# Altium schematic sheet Motor Control - Phase A.SchDoc: [9] Motor Control - Phase A
size A4; ApprovedBy: Nagy Richard; CheckedBy: Nagy Richard; Author: Nagy Richard; CompanyName: EmbedCore; DrawnBy: Nagy Richard; Engineer: Nagy Richard; Organization: EmbedCore; Revision: 1.0; SheetNumber: 9; SheetTotal: 25
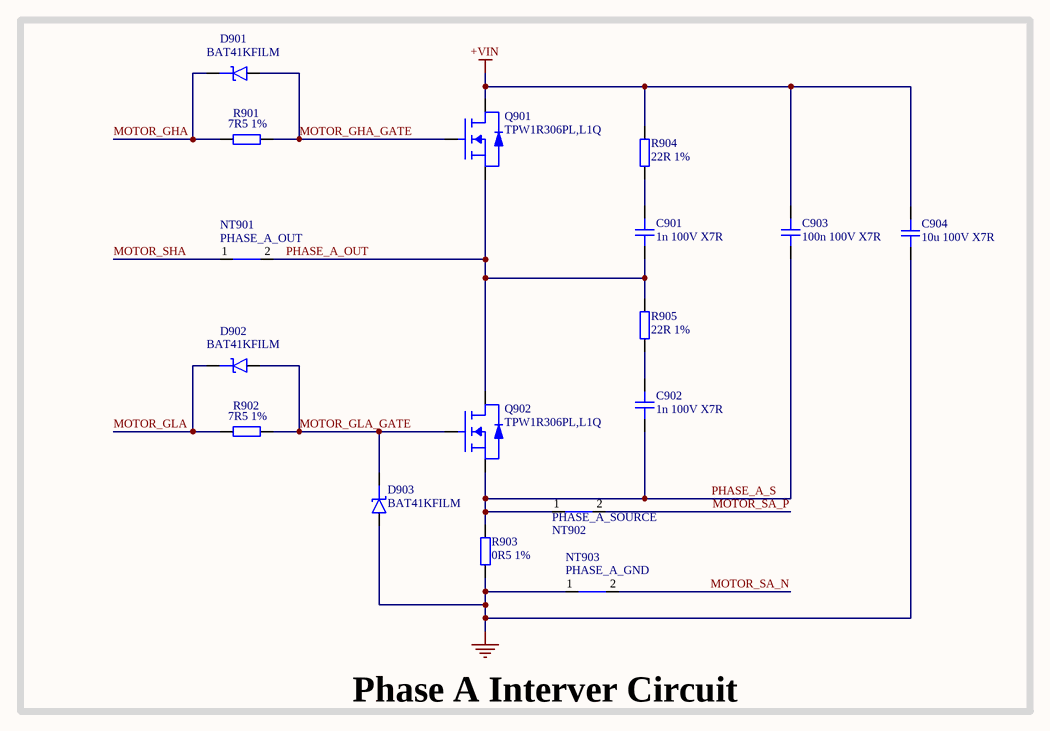
[diagram p0: Motor Control - Phase A.SchDoc]

## Parts
C901  1n 100V X7R  [CAP_0805]
C902  1n 100V X7R  [CAP_0805]
C903  100n 100V X7R  [CAP_1206]
C904  10u 100V X7R  [CAP_1210]
D901  BAT41KFILM  [SOD-523]
D902  BAT41KFILM  [SOD-523]
D903  BAT41KFILM  [SOD-523]
NT901  PHASE_A_OUT  [NETTIE_SMD]  (net tie, no BOM)
NT902  PHASE_A_SOURCE  [NETTIE_SMD]  (net tie, no BOM)
NT903  PHASE_A_GND  [NETTIE_SMD]  (net tie, no BOM)
Q901  TPW1R306PL,L1Q  [PowerPAK-SO-8]
Q902  TPW1R306PL,L1Q  [PowerPAK-SO-8]
R901  7R5 1%  [RES_0603]
R902  7R5 1%  [RES_0603]
R903  0R5 1%  [RES_1206]
R904  22R 1%  [RES_0805]
R905  22R 1%  [RES_0805]

## Blocks framed on the sheet
Phase A Interver Circuit: C901-C904 D901-D903 NT901-NT903 Q901 Q902 R901-R905

## Nets
+VIN: C903.2 C904.2 Q901.D R904.2
GND: C904.1 D903.A NT903.1 R903.1
MOTOR_GHA: D901.K R901.1
MOTOR_GHA_GATE: D901.A Q901.G R901.2
MOTOR_GLA: D902.K R902.1
MOTOR_GLA_GATE: D902.A D903.K Q902.G R902.2
MOTOR_SA_N: NT903.2
MOTOR_SA_P: NT902.2
MOTOR_SHA: NT901.1
PHASE_A_OUT: C901.1 NT901.2 Q901.S Q902.D R905.2
PHASE_A_S: C902.1 C903.1 NT902.1 Q902.S R903.2
NetC901_2: C901.2 R904.1
NetC902_2: C902.2 R905.1

## Notes on the sheet
- Title:
- Drawn By:
- Page Contents:
- Checked By:
- Size:
- Date:
- File:
- License:
- Email:
- A4
- Number:
- Time:
- Revision:
- Sheet
- Website:
- of

## Library data of the parts
C901 C902 = CAP_0805: Capacitor SMD 0805; Manufacturer: Kyocera AVX; Manufacturer Part Number: 08051C102JAT2A; Distributor Link: www.lcsc.com; LCSC: C2169492; Rating: *; Dielectric: *
C903 = CAP_1206: Capacitor SMD 1206; Manufacturer: YAGEO; Manufacturer Part Number: CC1206JKX7R0BB104; Distributor Link: www.lcsc.com; LCSC: C726629; Rating: *; Dielectric: *
C904 = CAP_1210: Capacitor SMD 1210; Manufacturer: PSA(Prosperity Dielectrics); Manufacturer Part Number: FS32X106K101EGG; Distributor Link: www.lcsc.com; LCSC: C5156756; Rating: *; Dielectric: *
D901-D903 = D_SCHOTTKY_SOD_523: Diode Schottky SMD SOD-323; Manufacturer: STMicroelectronics; Manufacturer Part Number: BAT41KFILM; LCSC: C73150
NT901-NT903 = NetTie_SMD: Net Tie SMD
Q901 Q902 = SIR500DP-T1-RE3: MOSFET N-Channel Vds=30V Id=351A Rds=470uR; Manufacturer: Vishay; Manufacturer Part Number: SIR500DP-T1-RE3
R901 R902 = RES_0603: Resistor SMD 0603; Manufacturer: PANASONIC; Manufacturer Part Number: ERJPA3J7R5V; Distributor Link: www.lcsc.com; LCSC: C445790
R903 = RES_1206: Resistor SMD 1206; Manufacturer: Milliohm; Manufacturer Part Number: HoSRX1206-3W-0.5mR-1%; Distributor Link: www.lcsc.com; LCSC: C18724161
R904 R905 = RES_0805: Resistor SMD 0805; Manufacturer: Viking Tech; Manufacturer Part Number: ARG05FTC0220; Distributor Link: www.lcsc.com; LCSC: C218436